# Altium schematic sheet BlockDiagram.SchDoc
size A4
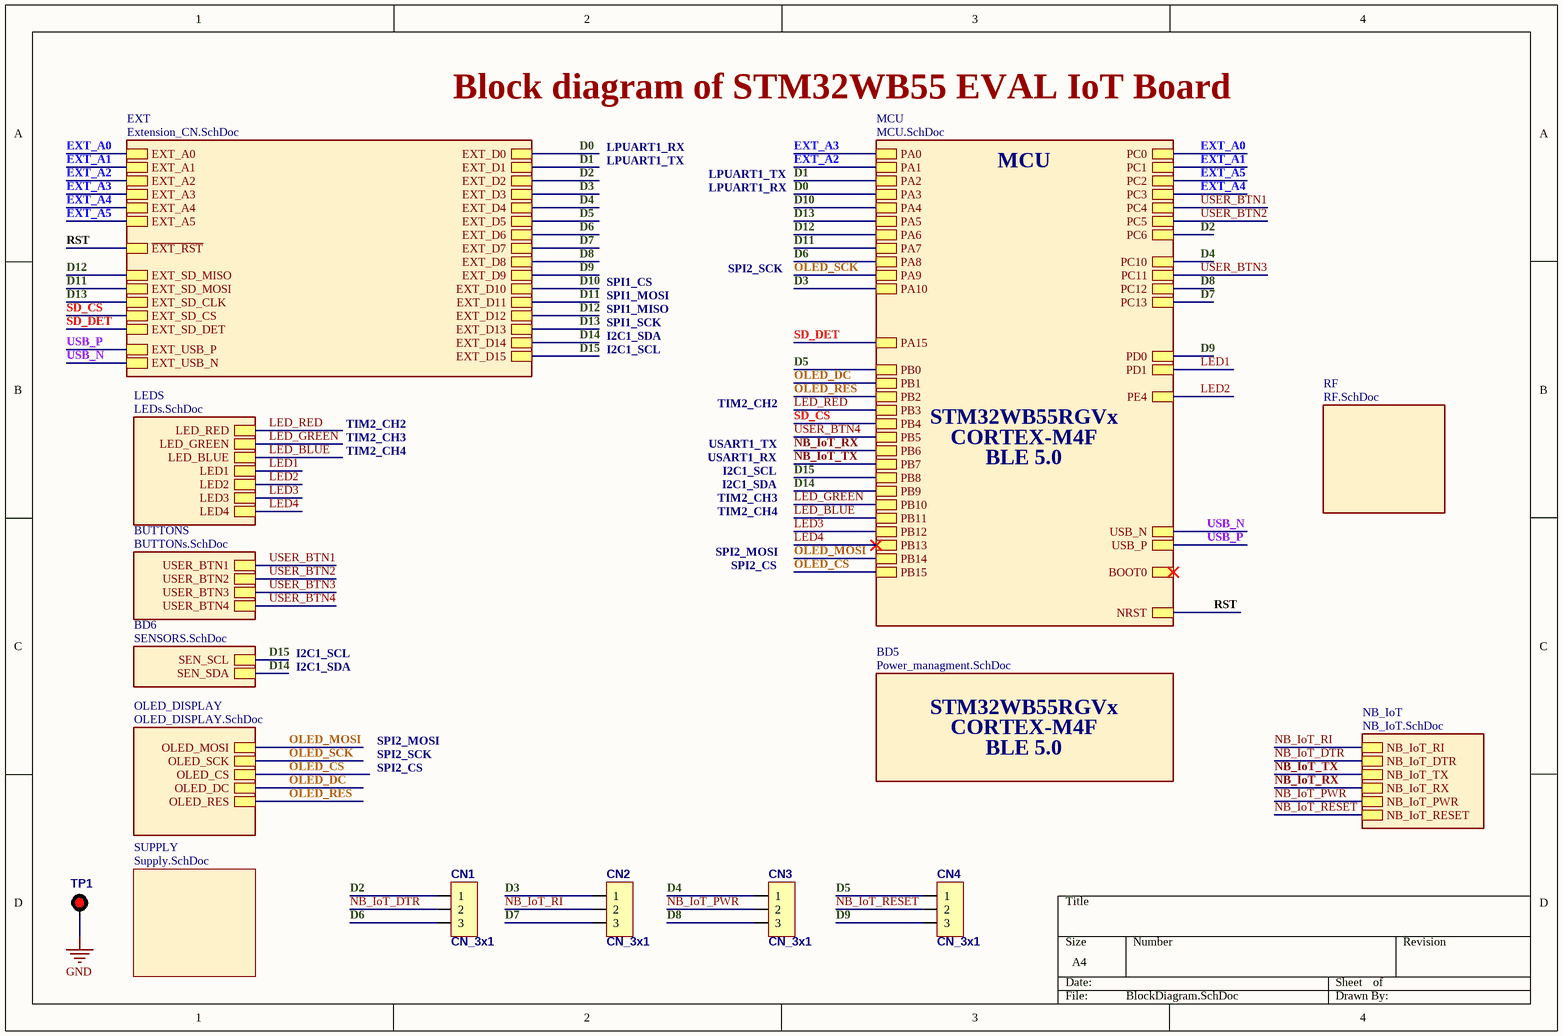
[diagram p0: BlockDiagram.SchDoc]

## Parts
CN1  CN_3x1  [GP_3x1_2mm]
CN2  CN_3x1  [GP_3x1_2mm]
CN3  CN_3x1  [GP_3x1_2mm]
CN4  CN_3x1  [GP_3x1_2mm]
TP1  Keystone 5000 Test Point (RED)  [Keystone_5000_RED]  (value not drawn)

## Sub-sheets
BD5 = Power_managment.SchDoc: no entries
BD6 = SENSORS.SchDoc: SEN_SCL, SEN_SDA
BUTTONS = BUTTONs.SchDoc: USER_BTN2, USER_BTN3, USER_BTN1, USER_BTN4
EXT = Extension_CN.SchDoc: EXT_SD_CS, EXT_SD_MOSI, EXT_A5, EXT_A2, EXT_A4, EXT_A3, EXT_A1, EXT_A0, EXT_USB_P, EXT_SD_CLK, EXT_SD_MISO, EXT_SD_DET, EXT_USB_N, ~{EXT_RST}, EXT_D4, EXT_D3, EXT_D6, EXT_D0, EXT_D2, EXT_D5, EXT_D1, EXT_D7, EXT_D8, EXT_D10, EXT_D15, EXT_D12, EXT_D14, EXT_D13, EXT_D9, EXT_D11
LEDS = LEDs.SchDoc: LED_GREEN, LED2, LED_BLUE, LED1, LED_RED, LED3, LED4
MCU = MCU.SchDoc: PE4, PC4, PC0, PC3, USB_N, PC11, PC10, PC13, PC2, PC6, PC12, BOOT0, USB_P, PC5, PC1, NRST, PA10, PA9, PA8, PA7, PA6, PA5, PA3, PA1, PA2, PA0, PA4, PA15, PD0, PD1, PB0, PB1, PB15, PB14, PB13, PB12, PB11, PB9, PB8, PB7, PB6, PB5, PB2, PB4, PB10, PB3
NB_IoT = NB_IoT.SchDoc: NB_IoT_RI, NB_IoT_PWR, NB_IoT_RESET, NB_IoT_TX, NB_IoT_DTR, NB_IoT_RX
OLED_DISPLAY = OLED_DISPLAY.SchDoc: OLED_MOSI, OLED_SCK, OLED_CS, OLED_DC, OLED_RES
RF = RF.SchDoc: no entries
SUPPLY = Supply.SchDoc: no entries

## Nets
GND: TP1.0
D0: sheet EXT/EXT_D0, sheet MCU/PA3
D1: sheet EXT/EXT_D1, sheet MCU/PA2
D2: CN1.1 ; sheet EXT/EXT_D2, sheet MCU/PC6
D3: CN2.1 ; sheet EXT/EXT_D3, sheet MCU/PA10
D4: CN3.1 ; sheet EXT/EXT_D4, sheet MCU/PC10
D5: CN4.1 ; sheet EXT/EXT_D5, sheet MCU/PB0
D6: CN1.3 ; sheet EXT/EXT_D6, sheet MCU/PA8
D7: CN2.3 ; sheet EXT/EXT_D7, sheet MCU/PC13
D8: CN3.3 ; sheet EXT/EXT_D8, sheet MCU/PC12
D9: CN4.3 ; sheet EXT/EXT_D9, sheet MCU/PD0
D10: sheet EXT/EXT_D10, sheet MCU/PA4
D11: sheet EXT/EXT_SD_MOSI, sheet EXT/EXT_D11, sheet MCU/PA7
D12: sheet EXT/EXT_SD_MISO, sheet EXT/EXT_D12, sheet MCU/PA6
D13: sheet EXT/EXT_SD_CLK, sheet EXT/EXT_D13, sheet MCU/PA5
D14: sheet EXT/EXT_D14, sheet MCU/PB9, sheet BD6/SEN_SDA
D15: sheet EXT/EXT_D15, sheet MCU/PB8, sheet BD6/SEN_SCL
EXT_A0: sheet EXT/EXT_A0, sheet MCU/PC0
EXT_A1: sheet EXT/EXT_A1, sheet MCU/PC1
EXT_A2: sheet EXT/EXT_A2, sheet MCU/PA1
EXT_A3: sheet EXT/EXT_A3, sheet MCU/PA0
EXT_A4: sheet EXT/EXT_A4, sheet MCU/PC3
EXT_A5: sheet EXT/EXT_A5, sheet MCU/PC2
LED1: sheet MCU/PD1, sheet LEDS/LED1
LED2: sheet MCU/PE4, sheet LEDS/LED2
LED3: sheet MCU/PB12, sheet LEDS/LED3
LED4: sheet MCU/PB13, sheet LEDS/LED4
LED_BLUE: sheet MCU/PB11, sheet LEDS/LED_BLUE
LED_GREEN: sheet MCU/PB10, sheet LEDS/LED_GREEN
LED_RED: sheet MCU/PB3, sheet LEDS/LED_RED
NB_IoT_DTR: CN1.2 ; sheet NB_IoT/NB_IoT_DTR
NB_IoT_PWR: CN3.2 ; sheet NB_IoT/NB_IoT_PWR
NB_IoT_RESET: CN4.2 ; sheet NB_IoT/NB_IoT_RESET
NB_IoT_RI: CN2.2 ; sheet NB_IoT/NB_IoT_RI
NB_IoT_RX: sheet MCU/PB6, sheet NB_IoT/NB_IoT_RX
NB_IoT_TX: sheet MCU/PB7, sheet NB_IoT/NB_IoT_TX
OLED_CS: sheet MCU/PB15, sheet OLED_DISPLAY/OLED_CS
OLED_DC: sheet MCU/PB1, sheet OLED_DISPLAY/OLED_DC
OLED_MOSI: sheet MCU/PB14, sheet OLED_DISPLAY/OLED_MOSI
OLED_RES: sheet MCU/PB2, sheet OLED_DISPLAY/OLED_RES
OLED_SCK: sheet MCU/PA9, sheet OLED_DISPLAY/OLED_SCK
RST: sheet EXT/~{EXT_RST}, sheet MCU/NRST
SD_CS: sheet EXT/EXT_SD_CS, sheet MCU/PB4
SD_DET: sheet EXT/EXT_SD_DET, sheet MCU/PA15
USB_N: sheet EXT/EXT_USB_N, sheet MCU/USB_N
USB_P: sheet EXT/EXT_USB_P, sheet MCU/USB_P
USER_BTN1: sheet MCU/PC4, sheet BUTTONS/USER_BTN1
USER_BTN2: sheet MCU/PC5, sheet BUTTONS/USER_BTN2
USER_BTN3: sheet MCU/PC11, sheet BUTTONS/USER_BTN3
USER_BTN4: sheet MCU/PB5, sheet BUTTONS/USER_BTN4

## Notes on the sheet
- Block diagram of STM32WB55 EVAL IoT Board
- LPUART1_RX
- LPUART1_TX
- MCU
- SPI1_MISO
- SPI1_MOSI
- SPI1_CS
- SPI2_SCK
- SPI1_SCK
- I2C1_SDA
- I2C1_SCL
- TIM2_CH4
- TIM2_CH3
- TIM2_CH2
- USART1_TX
- STM32WB55RGVx
- CORTEX-M4F
- USART1_RX
- BLE 5.0
- SPI2_MOSI
- SPI2_CS

## Library data of the parts
TP1 = Keystone 5000 Test Point